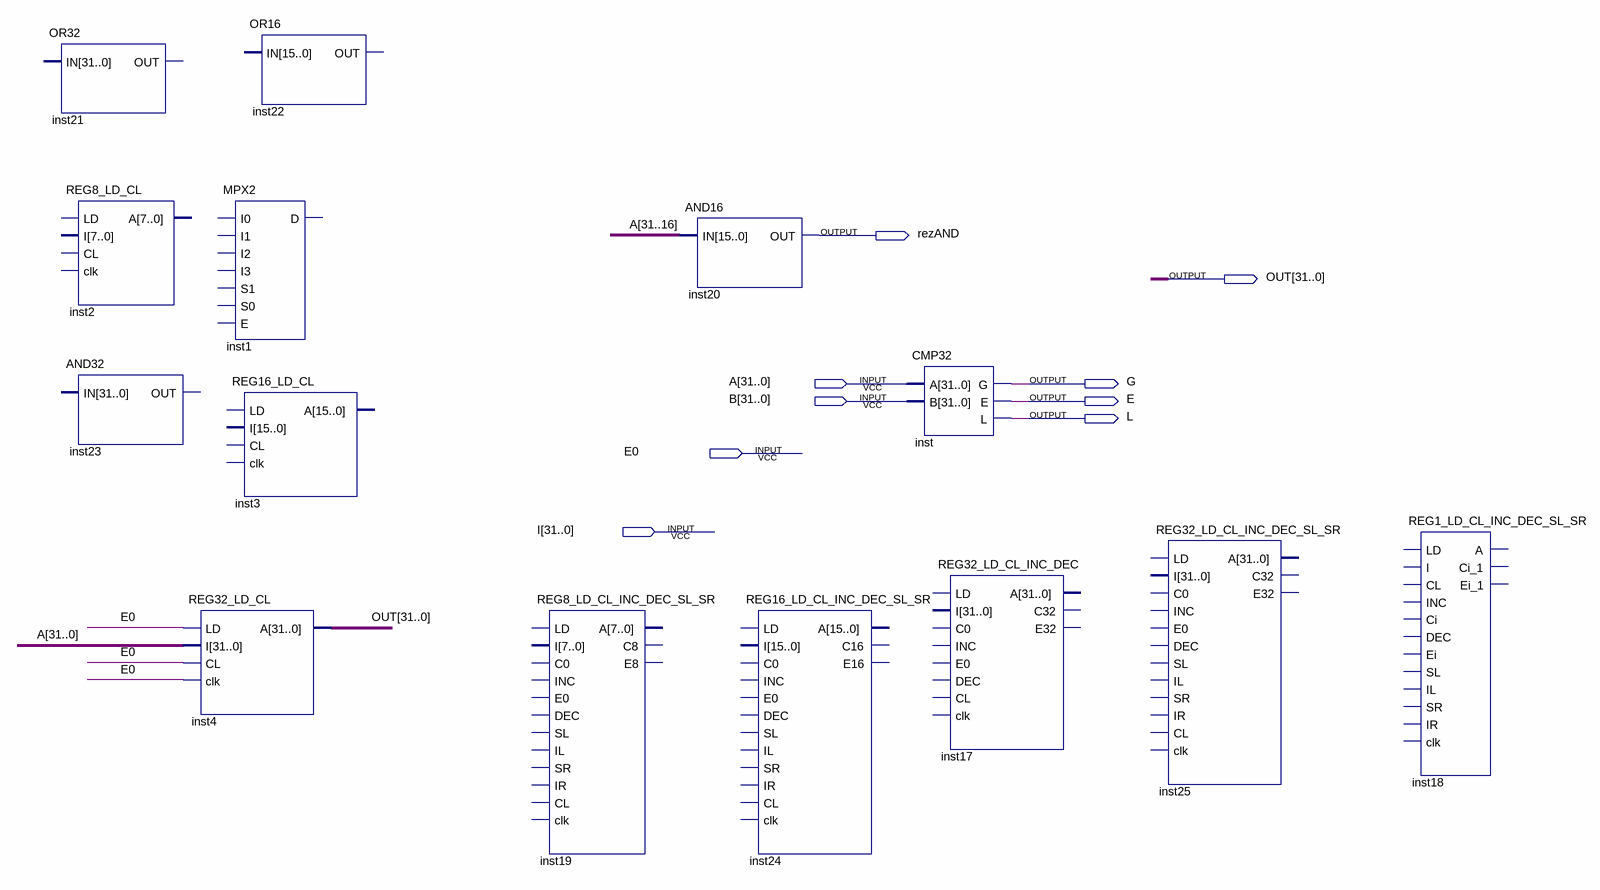
[diagram p0: schematic sheet]
// Quartus schematic komponente.bdf as structural Verilog: 14 symbols, 9 pins
module komponente (
  input  [31:0] A,
  input  [31:0] B,
  input  E0,
  input  [31:0] I,
  output rezAND,
  output [31:0] OUT,
  output G,
  output E,
  output L
);

  OR32 inst21 ();  // open: IN, OUT
  REG8_LD_CL inst2 ();  // open: LD, I, CL, clk, A
  AND32 inst23 ();  // open: IN, OUT
  MPX2 inst1 ();  // open: I0, I1, I2, I3, S1, S0, E, D
  REG32_LD_CL inst4 (.LD(E0), .I(A), .CL(E0), .clk(E0), .A(OUT));
  OR16 inst22 ();  // open: IN, OUT
  REG16_LD_CL inst3 ();  // open: LD, I, CL, clk, A
  REG8_LD_CL_INC_DEC_SL_SR inst19 ();  // open: LD, I, C0, INC, E0, DEC, SL, IL, SR, IR, CL, clk, A, C8, E8
  AND16 inst20 (.IN(A[31:16]), .OUT(rezAND));
  REG16_LD_CL_INC_DEC_SL_SR inst24 ();  // open: LD, I, C0, INC, E0, DEC, SL, IL, SR, IR, CL, clk, A, C16, E16
  CMP32 inst (.A(A), .B(B), .G(G), .E(E), .L(L));
  REG32_LD_CL_INC_DEC inst17 ();  // open: LD, I, C0, INC, E0, DEC, CL, clk, A, C32, E32
  REG32_LD_CL_INC_DEC_SL_SR inst25 ();  // open: LD, I, C0, INC, E0, DEC, SL, IL, SR, IR, CL, clk, A, C32, E32
  REG1_LD_CL_INC_DEC_SL_SR inst18 ();  // open: LD, I, CL, INC, Ci, DEC, Ei, SL, IL, SR, IR, clk, A, Ci_1, Ei_1
endmodule
